# Altium schematic sheet Misc.SchDoc
size A4 portrait; CompanyName: FairWaves LLC; DrawnBy: Andrey Sviyazov; DocumentNumber: 2; Revision: 1; SheetNumber: 2; SheetTotal: 5
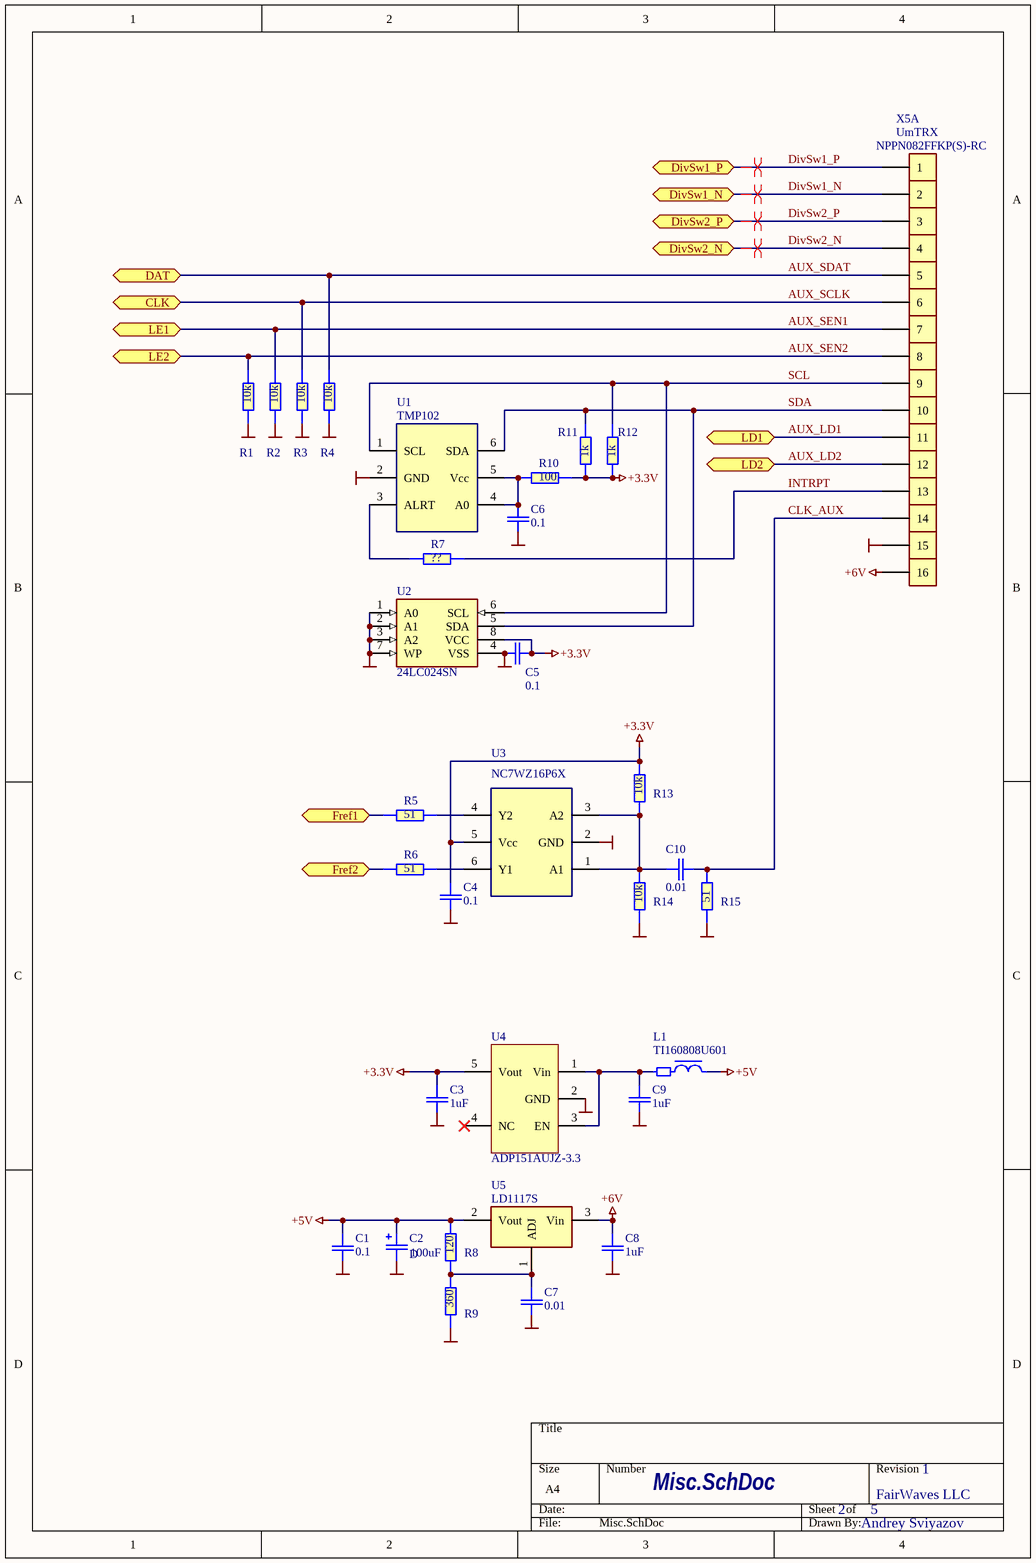
[diagram p0: Misc.SchDoc]

## Parts
C1  0.1  [C0603-Phillips]
C2  100uF  [cd7343]
C3  1uF  [C0603-Phillips]
C4  0.1  [C0603-Phillips]
C5  0.1  [C0603-Phillips]
C6  0.1  [C0603-Phillips]
C7  0.01  [C0603-Phillips]
C8  1uF  [C0603-Phillips]
C9  1uF  [C0603-Phillips]
C10  0.01  [C0603-Phillips]
L1  TI160808U601  [Ti160808-Phillips]
R1  10k  [R0603-PHILLIPS]
R2  10k  [R0603-PHILLIPS]
R3  10k  [R0603-PHILLIPS]
R4  10k  [R0603-PHILLIPS]
R5  51  [R0603-PHILLIPS]
R6  51  [R0603-PHILLIPS]
R7  ??  [R0603-PHILLIPS]
R8  120  [R0603-PHILLIPS]
R9  360  [R0603-PHILLIPS]
R10  100  [R0603-PHILLIPS]
R11  1k  [R0603-PHILLIPS]
R12  1k  [R0603-PHILLIPS]
R13  10k  [R0603-PHILLIPS]
R14  10k  [R0603-PHILLIPS]
R15  51  [R0603-PHILLIPS]
U1  TMP102  [PDSO-G6]
U2  24LC024SN  [SOIC8]
U3  NC7WZ16P6X  [SC70-6LD(SOT363)]
U4  ADP151AUJZ-3.3  [SOT-23-5[3.1x1.8/0.95]]
U5  LD1117S  [SOT-223-1]
X5  NPPN082FFKP(S)-RC  Misc: UmTRX  [NPPN082FFKP(S)]  (parts A,B,C,D,E,F,G,H,I,J,K,L,M,N,O,P of 16)

## Ports
CLK, DAT, DivSw1_N, DivSw1_P, DivSw2_N, DivSw2_P, Fref1, Fref2, LD1, LD2, LE1, LE2

## Nets
+3.3V: C3.2 C4.2 C5.2 R10.2 R11.1 R12.1 R13.1 U2.8(VCC) U3.5(Vcc) U4.5(Vout)
+5V: C1.2 C2.1(+) L1.1 R8.1 U5.2(Vout)
+6V: C8.2 U5.3(Vin) X5.16
GND: C1.1 C2.2(-) C3.1 C4.1 C5.1 C6.1 C7.1 C8.1 C9.1 R1.1 R2.1 R3.1 R4.1 R9.2 R14.2 R15.2 U1.2(GND) U2.1(A0) U2.2(A1) U2.3(A2) U2.4(VSS) U2.7(WP) U3.2(GND) U4.2(GND) X5.15
AUX_LD1: X5.11 ; port LD1
AUX_LD2: X5.12 ; port LD2
AUX_SCLK: R3.2 X5.6 ; port CLK
AUX_SDAT: R4.2 X5.5 ; port DAT
AUX_SEN1: R2.2 X5.7 ; port LE1
AUX_SEN2: R1.2 X5.8 ; port LE2
CLK_AUX: C10.1 R15.1 X5.14
DivSw1_N: X5.2 ; port DivSw1_N
DivSw1_P: X5.1 ; port DivSw1_P
DivSw2_N: X5.4 ; port DivSw2_N
DivSw2_P: X5.3 ; port DivSw2_P
Fref1: R5.1 ; port Fref1
Fref2: R6.1 ; port Fref2
INTRPT: R7.2 X5.13
SCL: R12.2 U1.1(SCL) U2.6(SCL) X5.9
SDA: R11.2 U1.6(SDA) U2.5(SDA) X5.10
NetC6_2: C6.2 R10.1 U1.4(A0) U1.5(Vcc)
NetC7_2: C7.2 R8.2 R9.1 U5.1(ADJ)
NetC9_2: C9.2 L1.2 U4.1(Vin) U4.3(EN)
NetC10_2: C10.2 R13.2 R14.1 U3.1(A1) U3.3(A2)
NetR5_2: R5.2 U3.4(Y2)
NetR6_2: R6.2 U3.6(Y1)
NetR7_1: R7.1 U1.3(ALRT)

Not connected (* = marked no-connect by the designer): U4 4(NC)*

## Layout directives
differential pair: DivSw1_N, DivSw1_P, DivSw2_N, DivSw2_P

## Notes on the sheet
- (in symbol CD7343) D

## Library data of the parts
C1 C3-C10 = C0603: Capacitor; Manufacturer: MURATA; Tolerance: 20%; Name: SMD0603; U/P/TKE: Y5V
  C1 C4-C6: Value: 0.1
  C3 C8 C9: Value: 1uF
  C7 C10: Value: 0.01
C2 = CD7343: Capacitor; Manufacturer: SPRAGUE; Name: CASE-D; U/P/TKE: 16V; Value: 100uF
L1 = TI160808: Choke; Manufacturer: MURATA; Name: TI160808U601; Value: *
R1-R15 = R0603: Resistor; Manufacturer: YAGEO; Tolerance: 5%; Name: SMD0603; U/P/TKE: 0.1W
  R1-R4 R13 R14: Value: 10k
  R5 R6 R15: Value: 51
  R7: Value: ??
  R8: Value: 120
  R9: Value: 360
  R10: Value: 100
  R11 R12: Value: 1k
U1 = TMP102: IC; Manufacturer: TI; Misc: Temperature Sensor I2C; Name: TMP102
U2 = AT24CXX: EEPROM; Manufacturer: Microchip; Swap: No; Name: 24LC024SN
U3 = NC7WZ16P6X: IC; Manufacturer: Fairchild; Name: NC7WZ16P6X
U4 = ADP151AUJZ: IC; Manufacturer: AD; Name: ADP151AUJZ-3.3
U5 = LD1117ADJ: IC; Manufacturer: STMicro; Swap: No; Name: LD1117S
X5 = NPPN082FFKP(S): Connector female 2mm SMD; Manufacturer: Sullins; Name: NPPN082FFKP(S)-RC